# EAGLE schematic main_board (EAGLE 6.5.0)
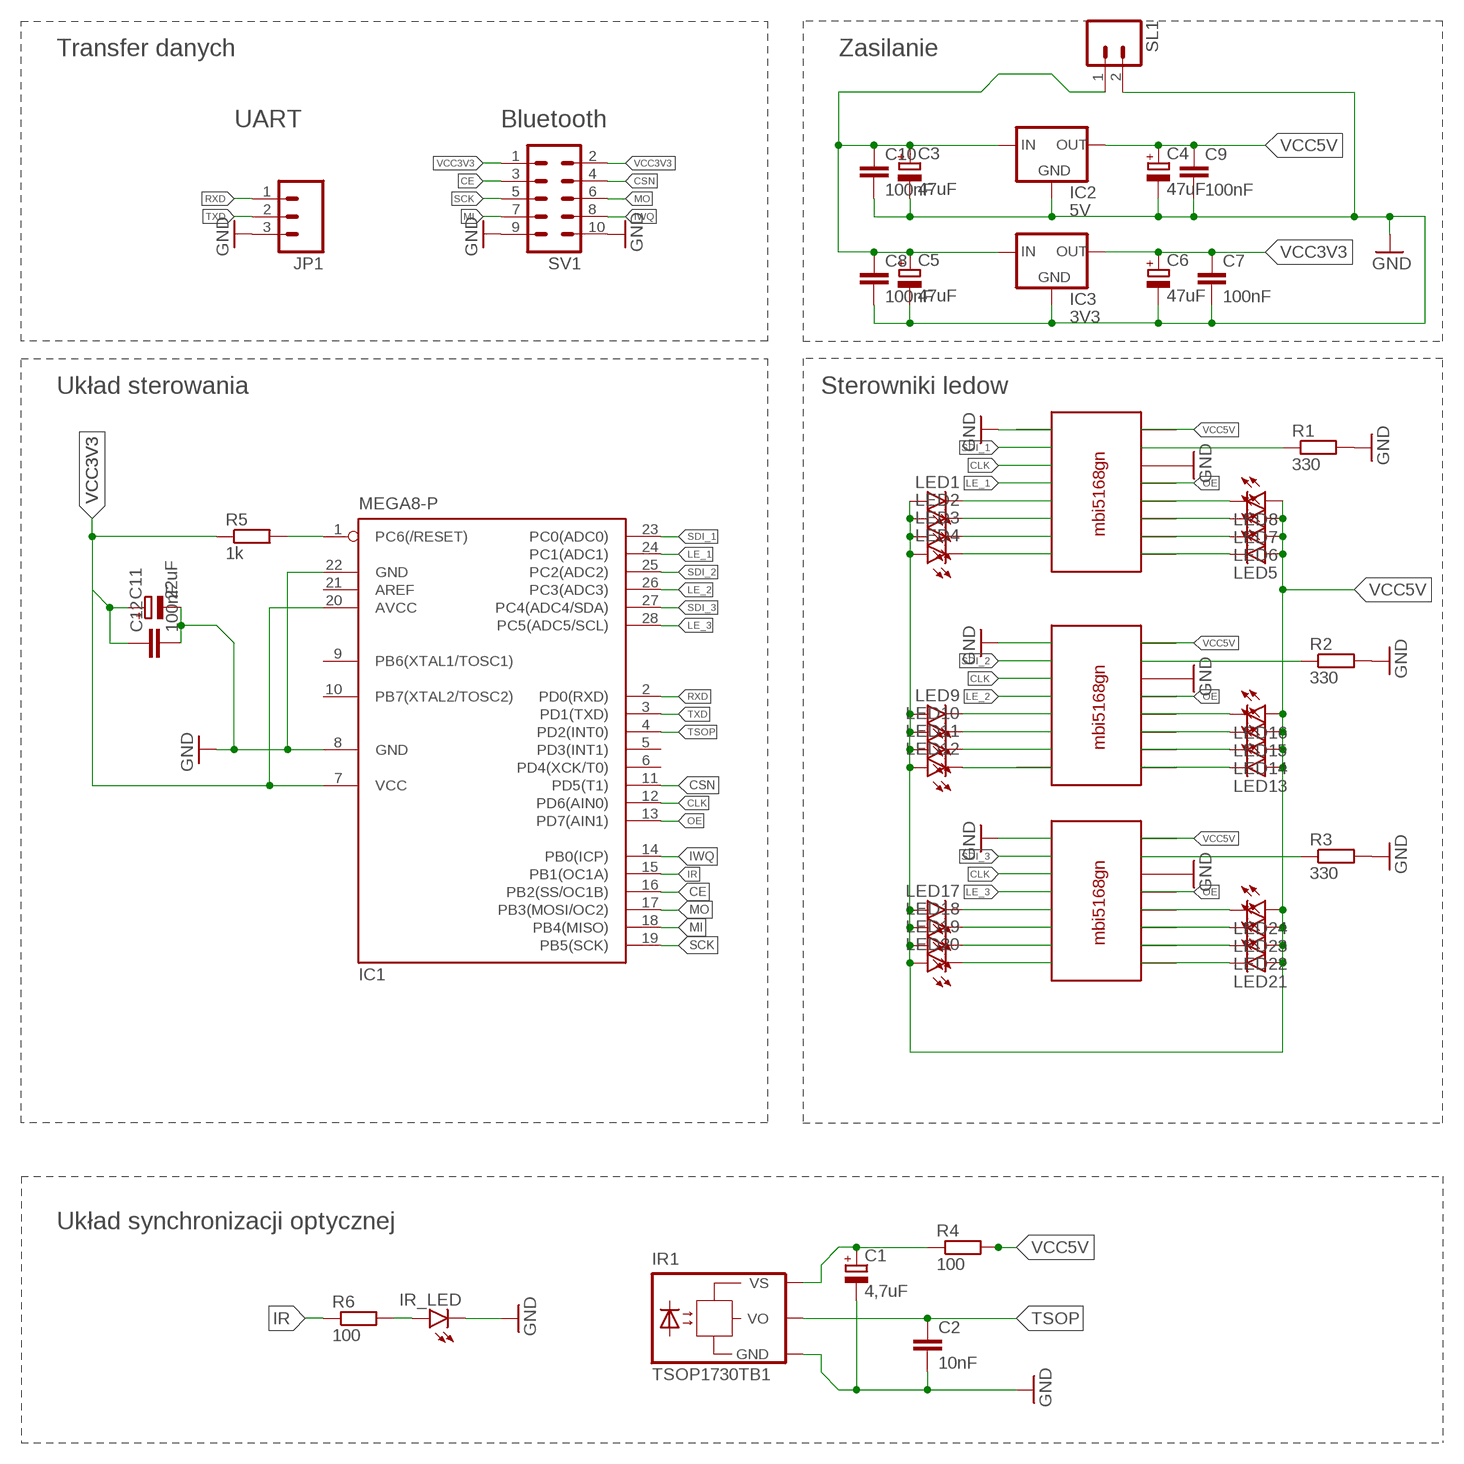
[diagram p0: schematic, sheet 1]

## Parts
C1  4,7uF  CPOL-EUB45181A  [B45181A]
C2  10nF  C-EU025-040X050  [C025-040X050]
C3  47uF  CPOL-EUB45181A  [B45181A]
C4  47uF  CPOL-EUB45181A  [B45181A]
C5  47uF  CPOL-EUB45181A  [B45181A]
C6  47uF  CPOL-EUB45181A  [B45181A]
C7  100nF  C-EUC0805  [C0805]
C8  100nF  C-EUC0805  [C0805]
C9  100nF  C-EUC0805  [C0805]
C10  100nF  C-EUC0805  [C0805]
C11  22uF  CPOL-EUB45181A  [B45181A]
C12  100nF  C-EU025-040X050  [C025-040X050]
IC1  MEGA8-P  [DIL28-3]
IC2  5V  V_REG_78XX-TO-220  [TO-220-ALT]
IC3  3V3  V_REG_78XX-TO-220  [TO-220-ALT]
IR1  TSOP1730TB1  [TSOP17_TB1]
IR_LED  LED5MM  [LED5MM]
JP1  M03PTH  [1X03]
LED1  LED3MM  [LED3MM]
LED2  LED3MM  [LED3MM]
LED3  LED3MM  [LED3MM]
LED4  LED3MM  [LED3MM]
LED5  LED3MM  [LED3MM]
LED6  LED3MM  [LED3MM]
LED7  LED3MM  [LED3MM]
LED8  LED3MM  [LED3MM]
LED9  LED3MM  [LED3MM]
LED10  LED3MM  [LED3MM]
LED11  LED3MM  [LED3MM]
LED12  LED3MM  [LED3MM]
LED13  LED3MM  [LED3MM]
LED14  LED3MM  [LED3MM]
LED15  LED3MM  [LED3MM]
LED16  LED3MM  [LED3MM]
LED17  LED3MM  [LED3MM]
LED18  LED3MM  [LED3MM]
LED19  LED3MM  [LED3MM]
LED20  LED3MM  [LED3MM]
LED21  LED3MM  [LED3MM]
LED22  LED3MM  [LED3MM]
LED23  LED3MM  [LED3MM]
LED24  LED3MM  [LED3MM]
R1  330  R-EU_M0805  [M0805]
R2  330  R-EU_M0805  [M0805]
R3  330  R-EU_M0805  [M0805]
R4  100  R-EU_M0805  [M0805]
R5  1k  R-EU_M0805  [M0805]
R6  100  R-EU_M0805  [M0805]
SL1  M02  [02P]
SV1  MA05-2  [MA05-2]
U$1  MBI5168GN  [DIL16]
U$2  MBI5168GN  [DIL16]
U$3  MBI5168GN  [DIL16]

## Nets
CE: IC1.16(PB2(SS/OC1B)) SV1.3
CLK: IC1.12(PD6(AIN0)) U$1.CLK U$2.CLK U$3.CLK
CSN: IC1.11(PD5(T1)) SV1.4
GND: C1.- C2.2 C3.- C4.- C5.- C6.- C7.2 C8.2 C9.2 C10.2 C11.- C12.2 IC1.8(GND) IC1.22(GND) IC2.GND IC3.GND IR1.GND IR_LED.K(C) JP1.3 R1.2 R2.2 R3.2 SL1.2 SV1.9 SV1.10 U$1.GND U$2.GND U$3.GND
IR: IC1.15(PB1(OC1A)) R6.1
IWQ: IC1.14(PB0(ICP)) SV1.8
LE_1: IC1.24(PC1(ADC1)) U$1.LE
LE_2: IC1.26(PC3(ADC3)) U$2.LE
LE_3: IC1.28(PC5(ADC5/SCL)) U$3.LE
MI: IC1.18(PB4(MISO)) SV1.7
MO: IC1.17(PB3(MOSI/OC2)) SV1.6
N$1: LED8.K(C) U$1.OUT7
N$2: LED7.K(C) U$1.OUT6
N$3: LED6.K(C) U$1.OUT5
N$4: LED5.K(C) U$1.OUT4
N$5: LED4.K(C) U$1.OUT3
N$6: LED3.K(C) U$1.OUT2
N$7: LED2.K(C) U$1.OUT1
N$8: LED1.K(C) U$1.OUT0
N$9: LED17.K(C) U$3.OUT0
N$10: LED18.K(C) U$3.OUT1
N$11: LED19.K(C) U$3.OUT2
N$12: LED20.K(C) U$3.OUT3
N$13: LED21.K(C) U$3.OUT4
N$14: LED22.K(C) U$3.OUT5
N$15: LED23.K(C) U$3.OUT6
N$16: LED24.K(C) U$3.OUT7
N$17: LED13.K(C) U$2.OUT4
N$18: LED14.K(C) U$2.OUT5
N$19: LED15.K(C) U$2.OUT6
N$20: LED16.K(C) U$2.OUT7
N$21: LED12.K(C) U$2.OUT3
N$22: LED11.K(C) U$2.OUT2
N$23: LED10.K(C) U$2.OUT1
N$24: LED9.K(C) U$2.OUT0
N$25: C3.+ C5.+ C8.1 C10.1 IC2.IN IC3.IN SL1.1
N$26: R1.1 U$1.R-EXT
N$28: C1.+ IR1.VS R4.1
N$29: R3.1 U$3.R-EXT
N$30: R2.1 U$2.R-EXT
N$35: IR_LED.A R6.2
N$36: IC1.1(PC6(/RESET)) R5.2
OE: IC1.13(PD7(AIN1)) U$1.OE U$2.OE U$3.OE
RXD: IC1.2(PD0(RXD)) JP1.1
SCK: IC1.19(PB5(SCK)) SV1.5
SDI_1: IC1.23(PC0(ADC0)) U$1.SDI
SDI_2: IC1.25(PC2(ADC2)) U$2.SDI
SDI_3: IC1.27(PC4(ADC4/SDA)) U$3.SDI
TSOP: C2.1 IC1.4(PD2(INT0)) IR1.VO
TXD: IC1.3(PD1(TXD)) JP1.2
VCC3V3: C6.+ C7.1 C11.+ C12.1 IC1.7(VCC) IC1.20(AVCC) IC3.OUT R5.1 SV1.1 SV1.2
VCC5V: C4.+ C9.1 IC2.OUT LED1.A LED2.A LED3.A LED4.A LED5.A LED6.A LED7.A LED8.A LED9.A LED10.A LED11.A LED12.A LED13.A LED14.A LED15.A LED16.A LED17.A LED18.A LED19.A LED20.A LED21.A LED22.A LED23.A LED24.A R4.2 U$1.VCC U$2.VCC U$3.VCC
Unconnected: IC1.5(PD3(INT1)) IC1.6(PD4(XCK/T0)) IC1.9(PB6(XTAL1/TOSC1)) IC1.10(PB7(XTAL2/TOSC2)) IC1.21(AREF) U$1.SDO U$2.SDO U$3.SDO

## Notes on the sheet
- Transfer danych | Zasilanie
- UART | Bluetooth
- Układ sterowania | Sterowniki ledow
- Układ synchronizacji optycznej

## Library data of the parts
C1 C3-C6 C11 = resistor:CPOL-EU: POLARIZED CAPACITOR, European symbol
C2 C7-C10 C12 = rcl:C-EU: CAPACITOR, European symbol
IC1 = atmel:MEGA8-P: MICROCONTROLLER 8 Kbytes FLASH, 1 kbytes SRAM, 512 bytes EEPROM, USART, 4-channel 10 bit ADC, 2-channel 8 bit ADC Pin compatible with Atmega48, ATMega88, ATMega168 Source: avr.lbr; OC_FARNELL: unknown; OC_NEWARK: unknown
IC2 IC3 = SparkFun-PowerIC:V_REG_78XX: Voltage Regulator Standard 7805 5V regulator. IGO (Input Ground Output). Spark Fun Electronics SKU : COM-00107
IR1 = telefunken:TSOP17*TB1: TSOP17..TB1 IR Receiver Modules for Remote Control Systems Source: http://www.vishay.com/docs/82042/82042.pdf; OC_FARNELL: unknown; OC_NEWARK: unknown
IR_LED LED1-LED24 = SparkFun-LED:LED: LEDs Standard schematic elements and footprints for 5mm, 3mm, 1206, and 0603 sized LEDs. 5mm - Spark Fun Electronics SKU : COM-00529 (and others)
JP1 = SparkFun-Connectors:M03: Header 3 Standard 3-pin 0.1" header. Use with straight break away headers (SKU : PRT-00116), right angle break away headers (PRT-00553), swiss pins (PRT-00743), machine pins (PRT-00117), and female headers (PRT-00115). Molex polarized connector foot print use with SKU : PRT-08232 with associated crimp pins and housings.
R1-R6 = resistor:R-EU_: RESISTOR, European symbol
SL1 = con-amp-quick:M02: AMP QUICK CONNECTOR; OC_FARNELL: unknown; OC_NEWARK: unknown
SV1 = con-lstb:MA05-2: PIN HEADER; OC_FARNELL: unknown; OC_NEWARK: unknown
U$1-U$3 = mbi5168gn:MBI5168GN